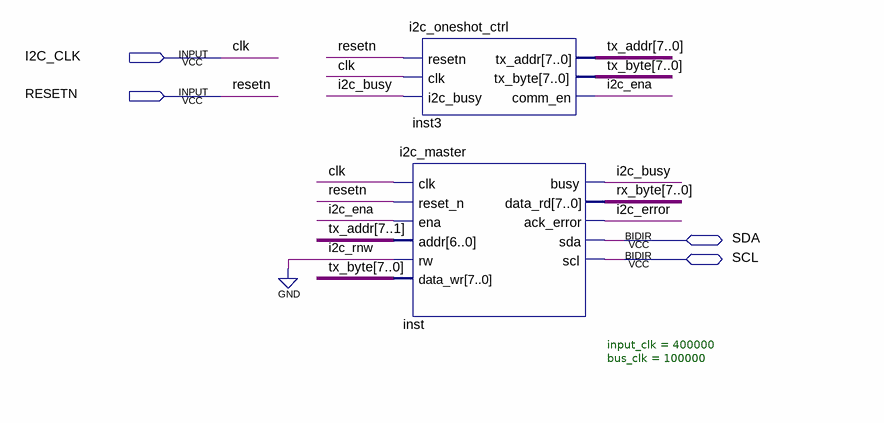
[diagram p0: schematic sheet]
// Quartus schematic oneshot_i2c.bdf as structural Verilog: 2 symbols, 4 pins
module oneshot_i2c (
  input  I2C_CLK,
  input  RESETN,
  inout  SDA,
  inout  SCL
);

  wire i2c_busy, i2c_ena, i2c_error;
  wire [7:0] rx_byte, tx_addr, tx_byte;

  i2c_oneshot_ctrl inst3 (
    .resetn(RESETN), .clk(I2C_CLK), .i2c_busy(i2c_busy), .tx_addr(tx_addr), .tx_byte(tx_byte),
    .comm_en(i2c_ena));
  i2c_master #(.input_clk(400000), .bus_clk(100000)) inst (
    .clk(I2C_CLK), .reset_n(RESETN), .ena(i2c_ena), .addr(tx_addr[7:1]), .rw(1'b0), .data_wr(tx_byte),
    .busy(i2c_busy), .data_rd(rx_byte), .ack_error(i2c_error), .sda(SDA), .scl(SCL));

  // Other names for the same wires on the sheet: clk = I2C_CLK
endmodule
